# EAGLE design lpc_boilerplate (EAGLE 5.10)
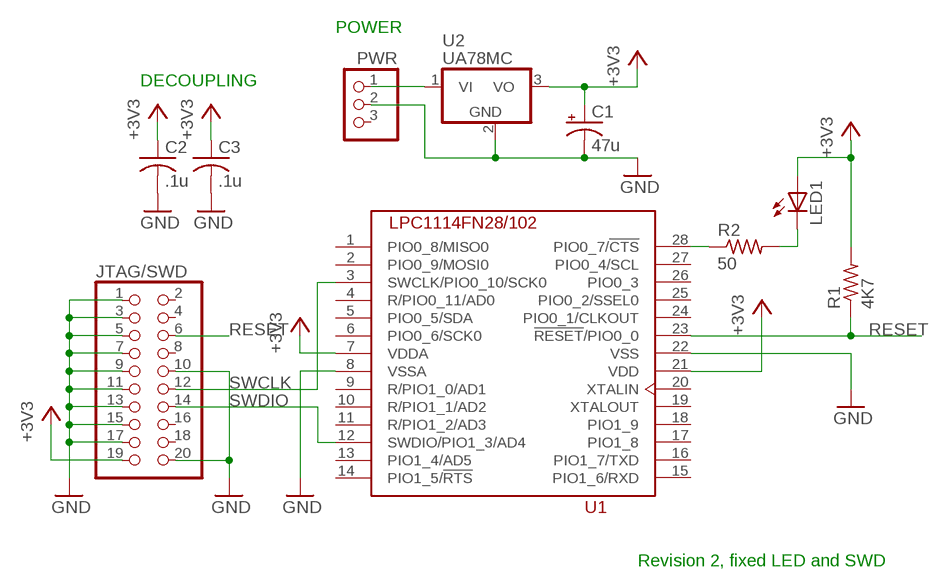
[diagram p0: schematic, sheet 1]

## Parts
C1  47u  CPOL-USE3.5-8  [E3,5-8]
C2  .1u  C-US050-024X044  [C050-024X044]
C3  .1u  C-US050-024X044  [C050-024X044]
JTAG/SWD  PINHD-2X10  [2X10]
LED1  LED10MM  [LED10MM]
PWR  PINHD-1X3  [1X03]
R1  4K7  R-US_0207/10  [0207/10]
R2  50  R-US_0207/10  [0207/10]
U1  LPC1114FN28/102  [DIL28-6]
U2  UA78MC  [TO220V]

## Nets
+3V3: C1.+ C2.1 C3.1 JTAG/SWD.19 LED1.A R1.2 U1.7(VDDA) U1.21(VDD) U2.3(VO)
GND: C1.- C2.2 C3.2 JTAG/SWD.1 JTAG/SWD.3 JTAG/SWD.5 JTAG/SWD.7 JTAG/SWD.9 JTAG/SWD.10 JTAG/SWD.11 JTAG/SWD.13 JTAG/SWD.15 JTAG/SWD.17 JTAG/SWD.20 PWR.2 U1.8(VSSA) U1.22(VSS) U2.2(GND)
N$1: LED1.K(C) R2.2
N$2: PWR.1 U2.1(VI)
N$3: R2.1 U1.28(PIO0_7/!CTS)
RESET: JTAG/SWD.6 R1.1 U1.23(!RESET!/PIO0_0)
SWCLK: JTAG/SWD.12 U1.3(SWCLK/PIO0_10/SCK0)
SWDIO: JTAG/SWD.14 U1.12(SWDIO/PIO1_3/AD4)
Unconnected: JTAG/SWD.2 JTAG/SWD.4 JTAG/SWD.8 JTAG/SWD.16 JTAG/SWD.18 PWR.3 U1.1(PIO0_8/MISO0) U1.2(PIO0_9/MOSI0) U1.4(R/PIO0_11/AD0) U1.5(PIO0_5/SDA) U1.6(PIO0_6/SCK0) U1.9(R/PIO1_0/AD1) U1.10(R/PIO1_1/AD2) U1.11(R/PIO1_2/AD3) U1.13(PIO1_4/AD5) U1.14(PIO1_5/!RTS) U1.15(PIO1_6/RXD) U1.16(PIO1_7/TXD) U1.17(PIO1_8) U1.18(PIO1_9) U1.19(XTALOUT) U1.20(XTALIN) U1.24(PIO0_1/CLKOUT) U1.25(PIO0_2/SSEL0) U1.26(PIO0_3) U1.27(PIO0_4/SCL)

## Notes on the sheet
- POWER
- DECOUPLING
- Revision 2, fixed LED and SWD

## Library data of the parts
C1 = rcl:CPOL-US: POLARIZED CAPACITOR, American symbol
C2 C3 = rcl:C-US: CAPACITOR, American symbol
JTAG/SWD = pinhead:PINHD-2X10: PIN HEADER
LED1 = led:LED: LED OSRAM: - CHIPLED LG R971, LG N971, LY N971, LG Q971, LY Q971, LO R971, LY R971 LH N974, LH R974 LS Q976, LO Q976, LY Q976 LO Q996 - Hyper CHIPLED LW Q18S LB Q993, LB Q99A, LB R99A - SideLED LS A670, LO A670, LY A670, LG A670, LP A670 LB A673, LV A673, LT A673, LW A673 LH A674 LY A675 LS A676, LA A676, LO A676, LY A676, LW A676 LS A679, LY A679, LG A679 - Hyper Micro SIDELED® LS Y876, LA Y876, LO Y876, LY Y876 LT Y87S - SmartLED LW L88C, LW L88S LB L89C, LB L89S, LG L890 LS L89K, LO L89K, LY L89K LS L896, LA L896, LO L896, LY L896 - TOPLED LS T670, LO T670, LY T670, LG T670, LP T670 LSG T670, LSP T670, LSY T670, LOP T670, LYG T670 LG T671, LOG T671, LSG T671 LB T673, LV T673, LT T673, LW T673 LH T674 LS T676, LA T676, LO T676, LY T676, LB T676, LH T676, LSB T676, LW T676 LB T67C, LV T67C, LT T67C, LS T67K, LO T67K, LY T67K, LW E67C LS E67B, LA E67B, LO E67B, LY E67B, LB E67C, LV E67C, LT E67C LW T67C LS T679, LY T679, LG T679 LS T770, LO T770, LY T770, LG T770, LP T770 LB T773, LV T773, LT T773, LW T773 LH T774 LS E675, LA E675, LY E675, LS T675 LS T776, LA T776, LO T776, LY T776, LB T776 LHGB T686 LT T68C, LB T68C - Hyper Mini TOPLED® LB M676 - Mini TOPLED Santana® LG M470 LS M47K, LO M47K, LY M47K Source: http://www.osram.convergy.de LUXEON: - LUMILED® LXK2-PW12-R00, LXK2-PW12-S00, LXK2-PW14-U00, LXK2-PW14-V00 LXK2-PM12-R00, LXK2-PM12-S00, LXK2-PM14-U00 LXK2-PE12-Q00, LXK2-PE12-R00, LXK2-PE12-S00, LXK2-PE14-T00, LXK2-PE14-U00 LXK2-PB12-K00, LXK2-PB12-L00, LXK2-PB12-M00, LXK2-PB14-N00, LXK2-PB14-P00, LXK2-PB14-Q00 LXK2-PR12-L00, LXK2-PR12-M00, LXK2-PR14-Q00, LXK2-PR14-R00 LXK2-PD12-Q00, LXK2-PD12-R00, LXK2-PD12-S00 LXK2-PH12-R00, LXK2-PH12-S00 LXK2-PL12-P00, LXK2-PL12-Q00, LXK2-PL12-R00 Source: www.luxeon.com KINGBRIGHT: KA-3528ASYC Source: www.kingbright.com
PWR = pinhead:PINHD-1X3: PIN HEADER
R1 R2 = rcl:R-US_: RESISTOR, American symbol
U1 = lpc_11xx:LPC1114FN28/102
U2 = lpc_11xx:UA78M*C

## Board
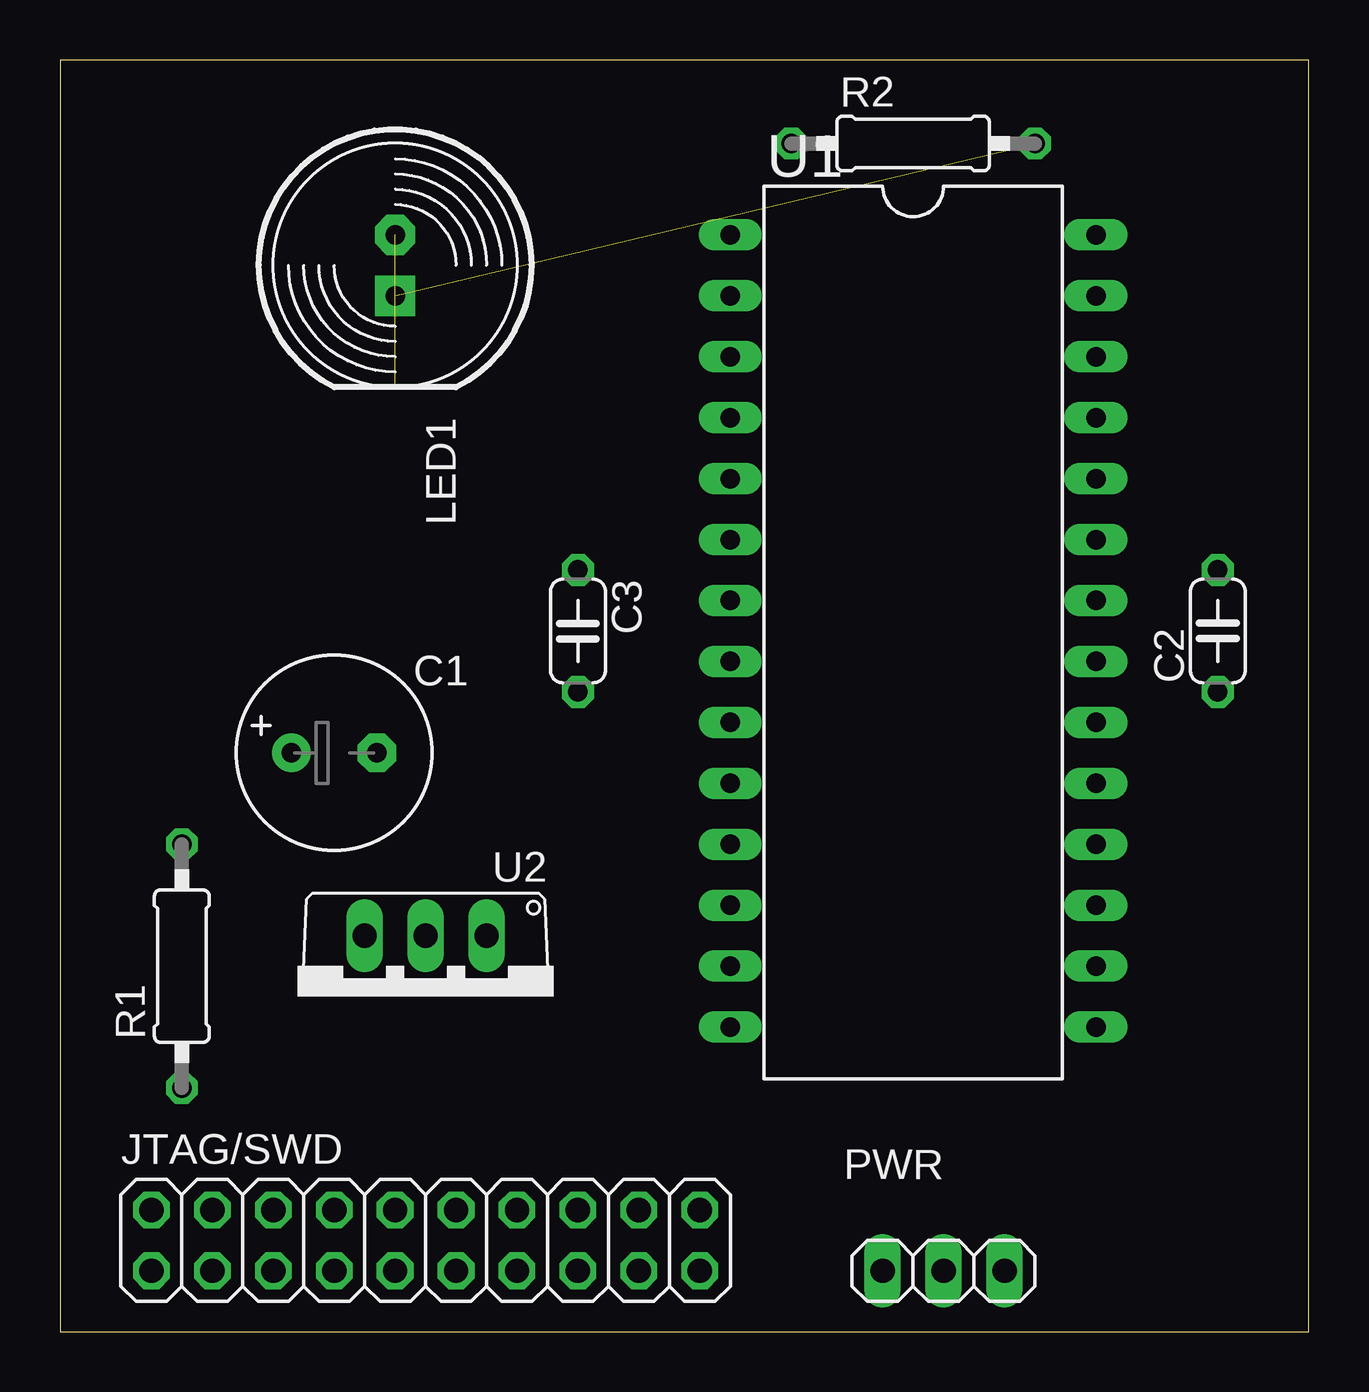
[diagram p1: board, top side]
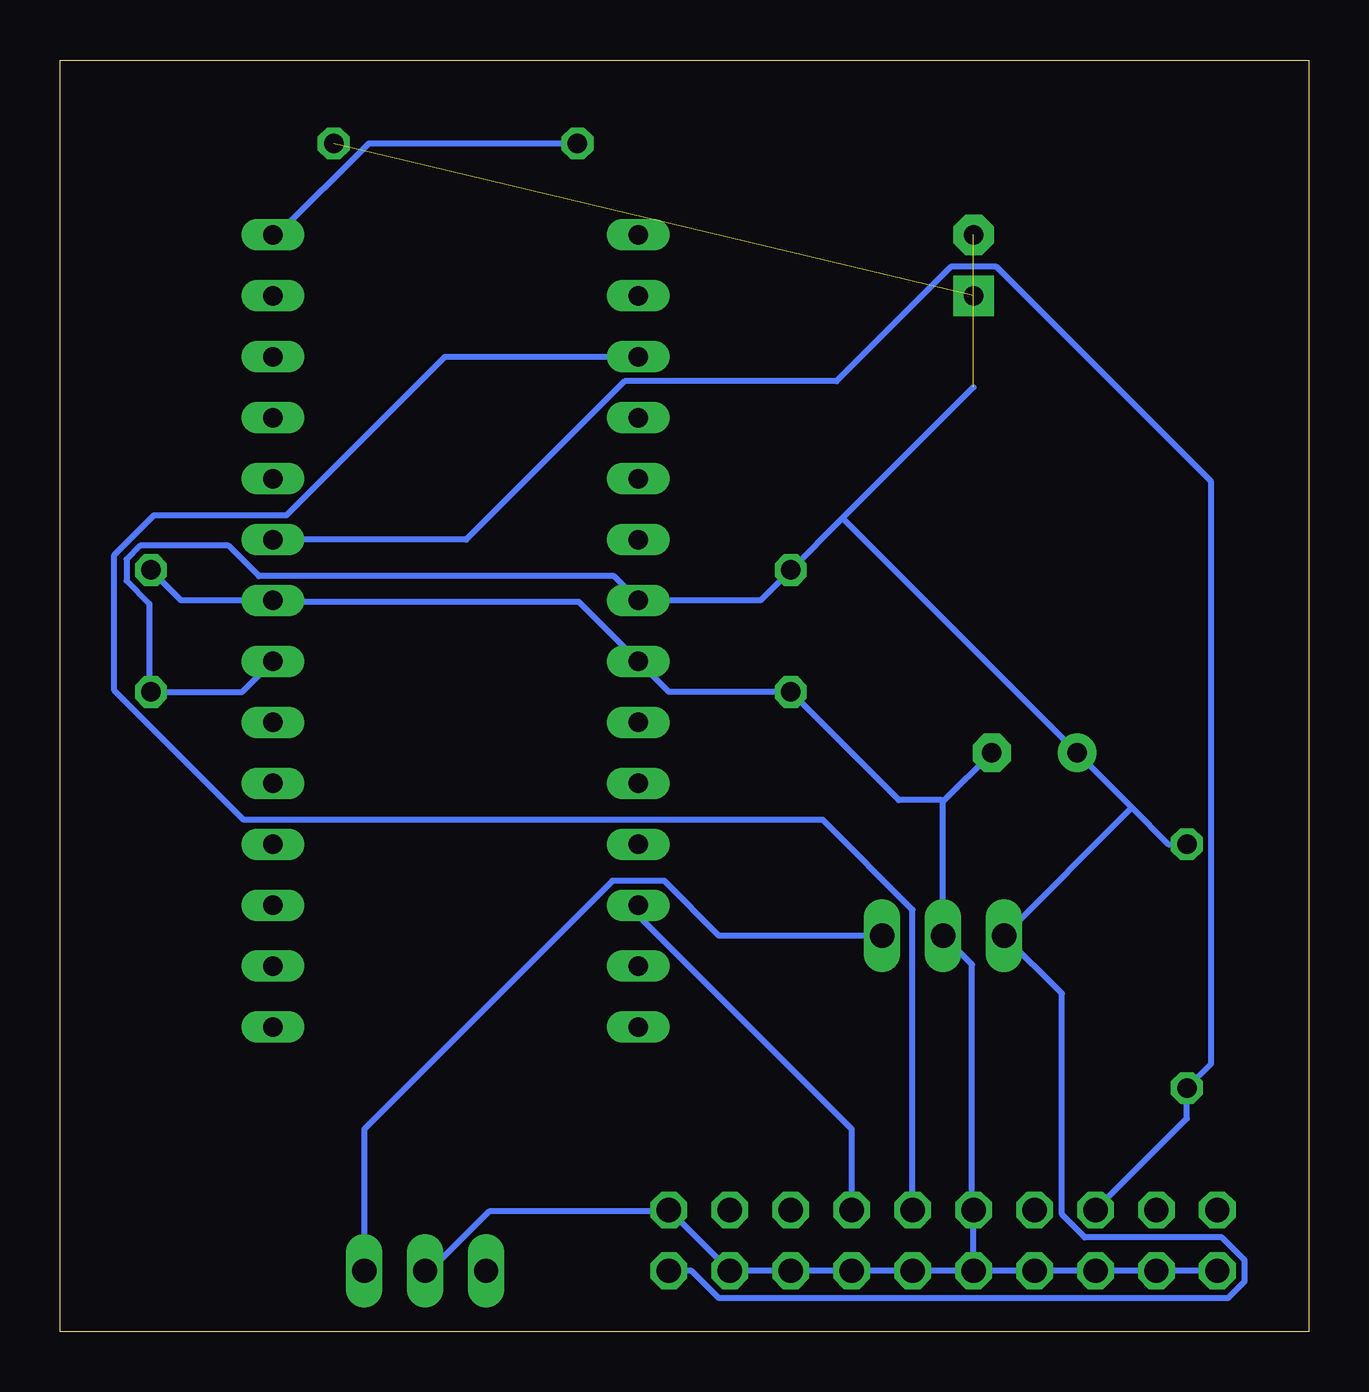
[diagram p2: board, bottom side, seen from below]

Size 52.05 x 53.01 mm. Coordinates in mm from the lower left corner, seen from the top.
Outline: 0,0 52.05,0 52.05,53.01 0,53.01 0,0
Copper layers (1*16): Top 0.035mm / dielectric 1.5mm / Bottom 0.035mm
Design rules "default": minimum track width 10mil, minimum drill 24mil, track to track 8mil, track to pad 8mil, pad to pad 8mil, via to via 8mil, smd to smd 8mil, copper to edge 40mil, drill to drill 8mil, minimum pad ring 10mil, minimum via ring 8mil, stop-mask expansion 4mil, vias tented up to drill 0mil, thermal gap 10mil

### Footprints (pad centres in the part's own frame; a part is rotated, then mirrored left to right if it is on the bottom)
E3,5-8 = drill 0.813 pad 1.6 round: + -1.778,0 | drill 0.813 pad 1.6 octagon: - 1.778,0
C050-024X044 = drill 0.813 octagon: 1 -2.54,0; 2 2.54,0
2X10 = drill 1.016 octagon: 1 -11.43,-1.27; 2 -11.43,1.27; 3 -8.89,-1.27; 4 -8.89,1.27; 5 -6.35,-1.27; 6 -6.35,1.27; 7 -3.81,-1.27; 8 -3.81,1.27; 9 -1.27,-1.27; 10 -1.27,1.27; 11 1.27,-1.27; 12 1.27,1.27; 13 3.81,-1.27; 14 3.81,1.27; 15 6.35,-1.27; 16 6.35,1.27; 17 8.89,-1.27; 18 8.89,1.27; 19 11.43,-1.27; 20 11.43,1.27
LED10MM = drill 0.813 pad 1.676 octagon: A -1.27,0 | drill 0.813 pad 1.676 square: K 1.27,0
1X03 = drill 1.016 long: 1 -2.54,0; 2 0,0; 3 2.54,0
0207/10 = drill 0.813 octagon: 1 -5.08,0; 2 5.08,0
DIL28-6 = drill 0.813 long: 1 -16.51,-7.62; 2 -13.97,-7.62; 3 -11.43,-7.62; 4 -8.89,-7.62; 5 -6.35,-7.62; 6 -3.81,-7.62; 7 -1.27,-7.62; 8 1.27,-7.62; 9 3.81,-7.62; 10 6.35,-7.62; 11 8.89,-7.62; 12 11.43,-7.62; 13 13.97,-7.62; 14 16.51,-7.62; 15 16.51,7.62; 16 13.97,7.62; 17 11.43,7.62; 18 8.89,7.62; 19 6.35,7.62; 20 3.81,7.62; 21 1.27,7.62; 22 -1.27,7.62; 23 -3.81,7.62; 24 -6.35,7.62; 25 -8.89,7.62; 26 -11.43,7.62; 27 -13.97,7.62; 28 -16.51,7.62
TO220V = drill 1.016 long: 1 -2.54,-2.54; 2 0,-2.54; 3 2.54,-2.54

### Placement (x,y rotation side)
C1  11.43,24.13 0 top
C2  48.26,29.21 90 top
C3  21.59,29.21 270 top
JTAG/SWD  15.24,3.81 0 top
LED1  13.97,44.45 270 top
PWR  36.83,2.54 180 top
R1  5.08,15.24 90 top
R2  35.56,49.53 0 top
U1  35.56,29.21 270 top
U2  15.24,13.97 180 top

### Tracks (layer width: path | path; a pad name or v marks a point on that pad's centre or on a via)
+3V3  (1 unrouted)
  Bottom 0.254: R1.2 5.84,20.32 7.37,21.84 | 7.37,21.84 C1.+ 19.43,33.91 | 7.37,21.84 U2.3 10.29,14.1 10.29,4.89 9.34,3.94 3.62,3.94 2.67,2.98 2.67,2.1 3.37,1.4 24.57,1.4 25.72,2.54 JTAG/SWD.19 | U1.21 44.45,26.67 C2.1 48.32,26.73 48.32,30.35 49.28,31.3 49.28,32.19 48.7,32.77 45.02,32.77 43.75,31.5 28.96,31.5 U1.7 22.86,30.48 C3.1 19.43,33.91 | 19.43,33.91 13.97,39.37
GND
  Bottom 0.254: JTAG/SWD.1 JTAG/SWD.3 JTAG/SWD.5 JTAG/SWD.7 JTAG/SWD.9 | JTAG/SWD.9 JTAG/SWD.10 14.03,5.14 14.03,15.3 U2.2 15.24,22.1 | JTAG/SWD.9 JTAG/SWD.11 JTAG/SWD.13 JTAG/SWD.15 JTAG/SWD.17 JTAG/SWD.20 26.73,5.02 34.16,5.02 36.64,2.54 PWR.2 | 15.24,22.1 C1.- | C2.2 46.99,30.48 U1.22 43.12,30.42 30.42,30.42 U1.8 26.67,26.67 C3.2 17.08,22.16 15.3,22.16 15.24,22.1
N$1  (1 unrouted)
N$2
  Bottom 0.254: U2.1 24.57,16.51 26.86,18.8 29.02,18.8 39.37,8.45 PWR.1
N$3
  Bottom 0.254: R2.1 39.18,49.53 42.99,45.72 U1.28
RESET
  Bottom 0.254: JTAG/SWD.6 5.08,8.89 R1.1 4.06,11.18 4.06,35.43 13.02,44.39 14.92,44.39 19.68,39.62 28.51,39.62 35.12,33.02 U1.23
SWCLK
  Bottom 0.254: U1.3 36.01,40.64 42.61,34.04 48.13,34.04 49.78,32.38 49.78,26.73 44.39,21.34 20.26,21.34 16.51,17.59 JTAG/SWD.12
SWDIO
  Bottom 0.254: U1.12 27.94,17.34 19.05,8.45 JTAG/SWD.14